# Altium schematic sheet UserInput.SchDoc
size A0
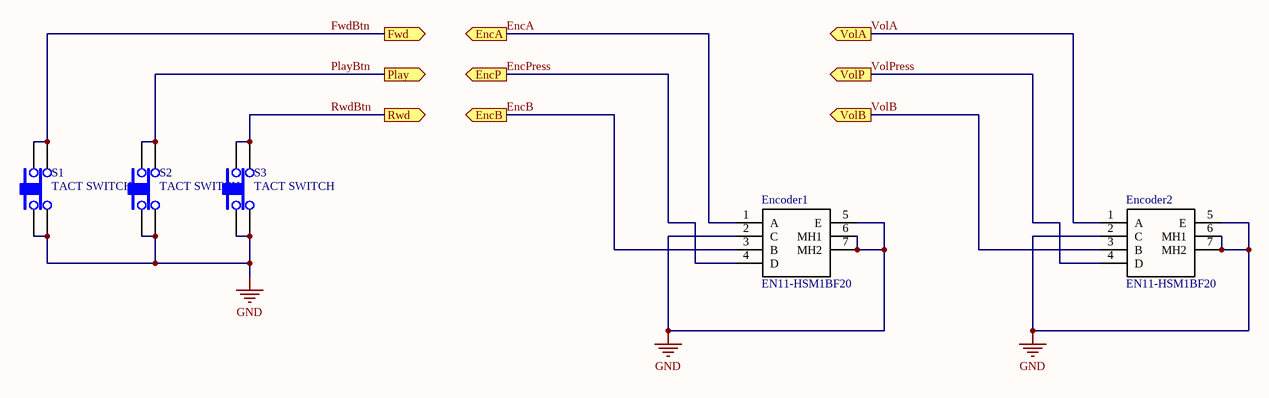
[diagram p0: UserInput.SchDoc]

## Parts
Encoder1  EN11-HSM1BF20  [EN11HSM1BF20]
Encoder2  EN11-HSM1BF20  [EN11HSM1BF20]
S1  TACT SWITCH  [TACTSWITCH]
S2  TACT SWITCH  [TACTSWITCH]
S3  TACT SWITCH  [TACTSWITCH]

## Ports
EncA (out), EncB (out), EncP (out), Fwd (out), Play (out), Rwd (out), VolA (out), VolB (out), VolP (out)

## Nets
GND: Encoder1.2(C) Encoder1.5(E) Encoder1.6(MH1) Encoder1.7(MH2) Encoder2.2(C) Encoder2.5(E) Encoder2.6(MH1) Encoder2.7(MH2) S1.1 S1.2 S2.1 S2.2 S3.1 S3.2
EncA: Encoder1.1(A) ; port EncA
EncB: Encoder1.3(B) ; port EncB
EncPress: Encoder1.4(D) ; port EncP
FwdBtn: S1.3 S1.4 ; port Fwd
PlayBtn: S2.3 S2.4 ; port Play
RwdBtn: S3.3 S3.4 ; port Rwd
VolA: Encoder2.1(A) ; port VolA
VolB: Encoder2.3(B) ; port VolB
VolPress: Encoder2.4(D) ; port VolP

## Library data of the parts
Encoder1 Encoder2 = EN11-HSM1BF20: Switch; Manufacturer_Name: TT Electronics/BI Magnetics; Datasheet Link: http://www.ttelectronics.com/sites/default/files/download-files/Datasheet_RotaryEncoder_EN11Series.pdf; Height: 26mm; Manufacturer_Part_Number: EN11-HSM1BF20